# Altium schematic sheet RGB_LEDs.SchDoc: 2225B_VumetreFrequentiel
size 408 x 276 mm; Date: 24.09.2024; DrawnBy: LDA; DocumentNumber: 1.0; SheetNumber: 4; SheetTotal: 6
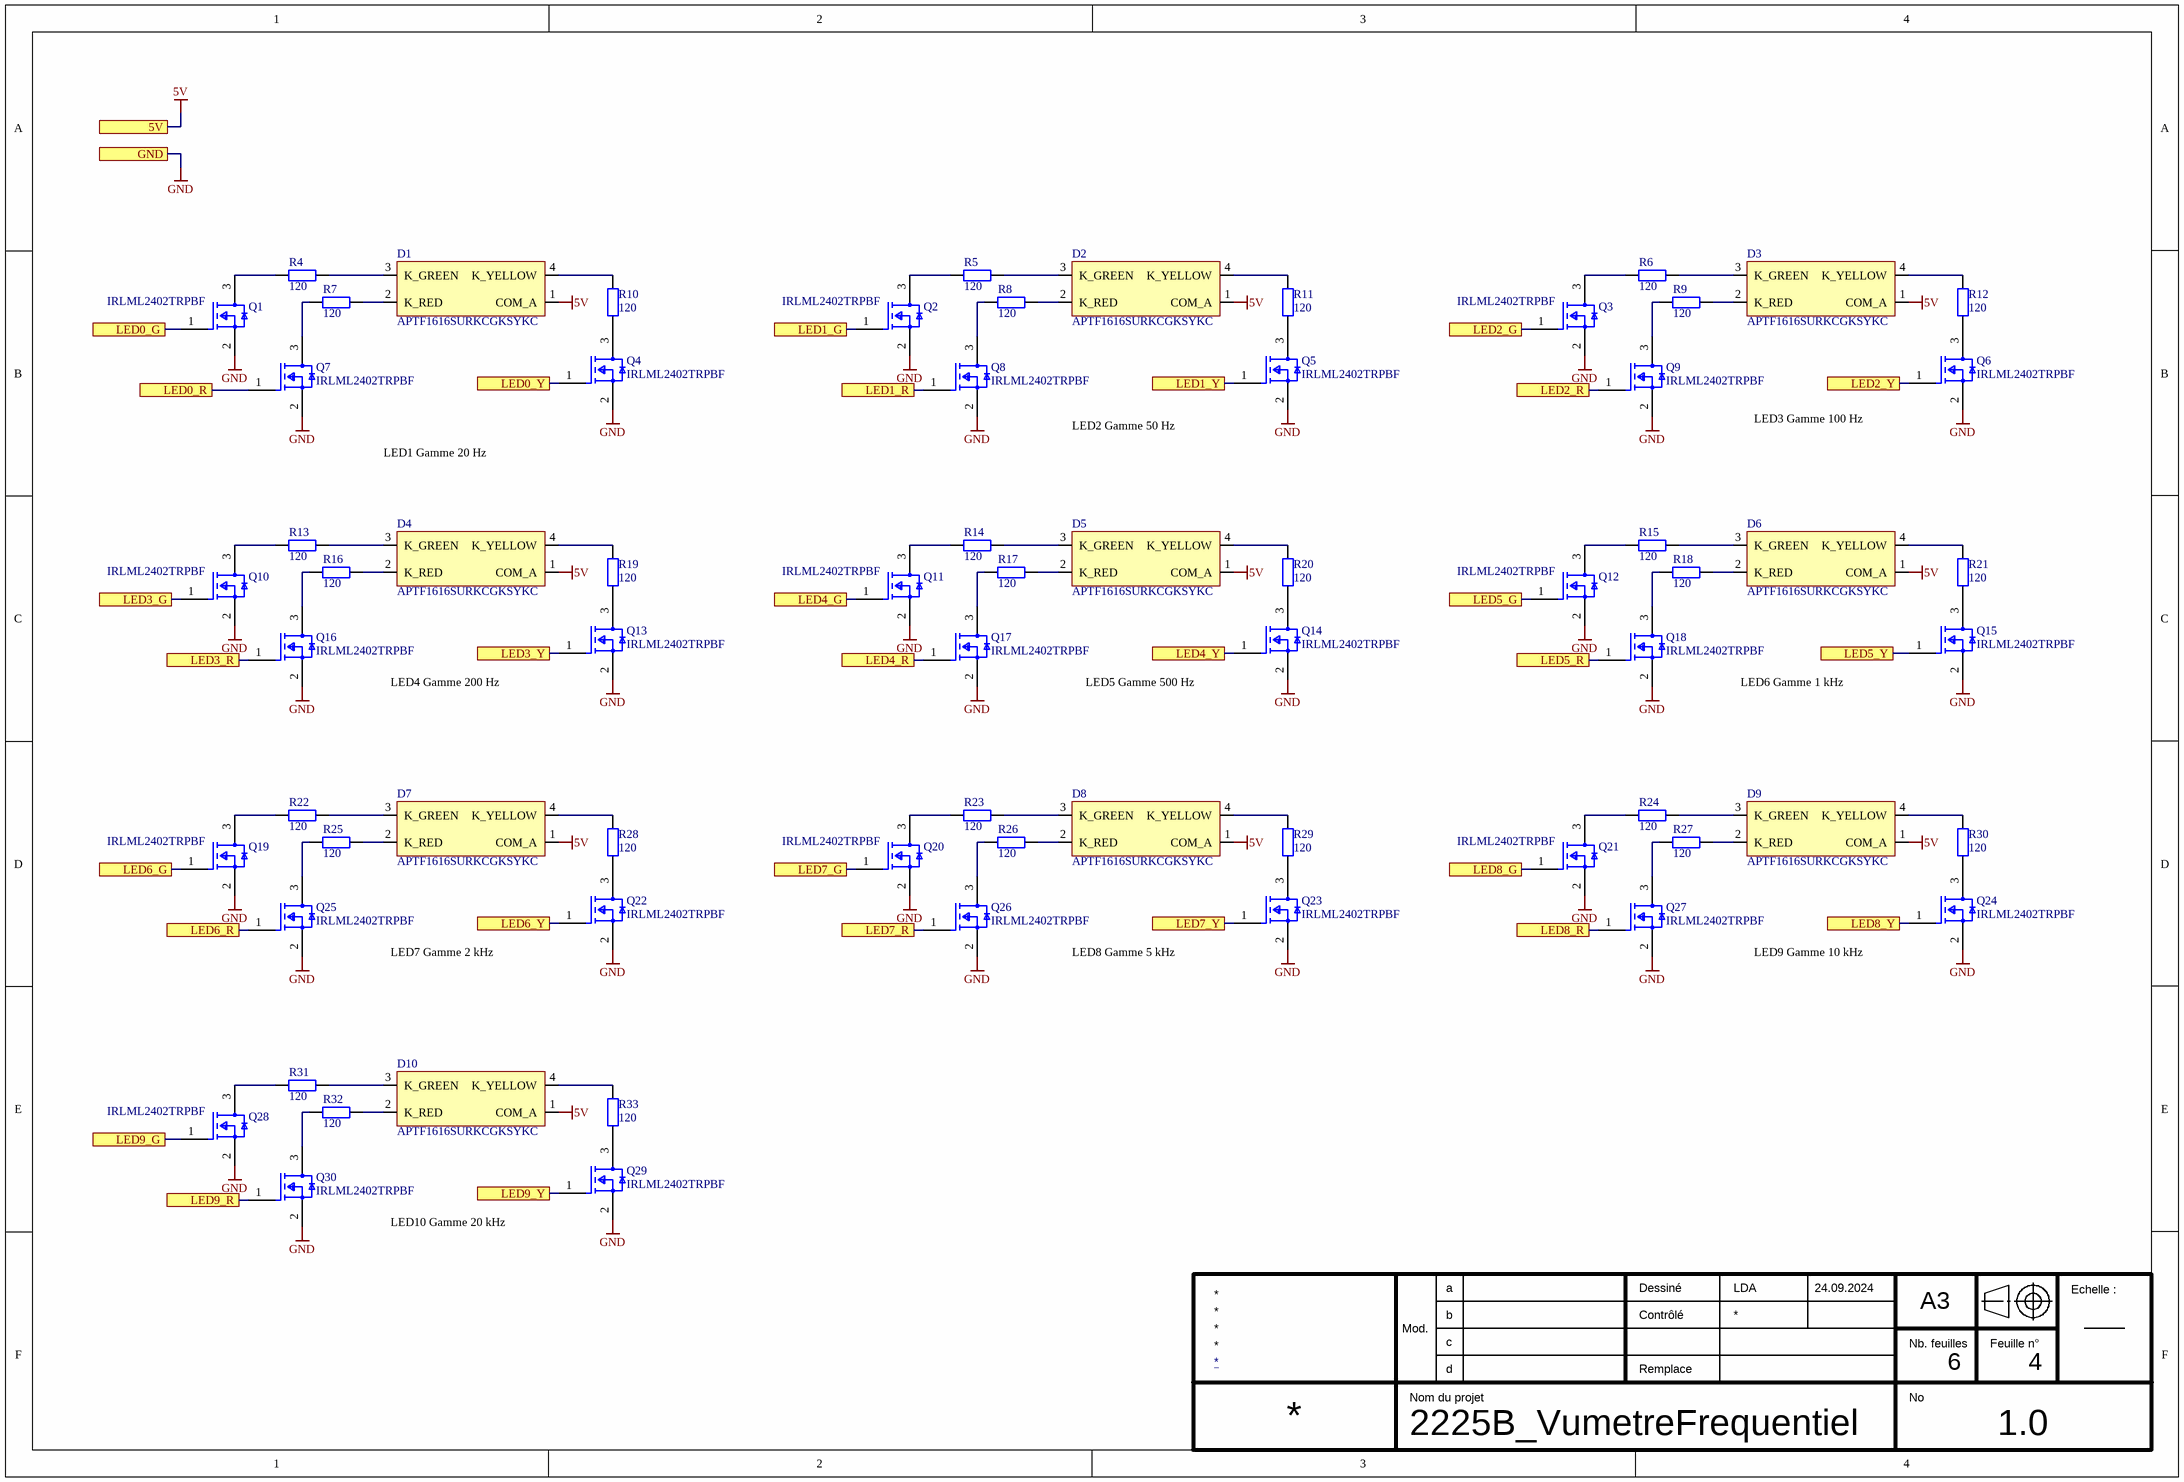
[diagram p0: RGB_LEDs.SchDoc]

## Parts
D1  APTF1616SURKCGKSYKC  [APTF1616SURKCGKSYKC]
D2  APTF1616SURKCGKSYKC  [APTF1616SURKCGKSYKC]
D3  APTF1616SURKCGKSYKC  [APTF1616SURKCGKSYKC]
D4  APTF1616SURKCGKSYKC  [APTF1616SURKCGKSYKC]
D5  APTF1616SURKCGKSYKC  [APTF1616SURKCGKSYKC]
D6  APTF1616SURKCGKSYKC  [APTF1616SURKCGKSYKC]
D7  APTF1616SURKCGKSYKC  [APTF1616SURKCGKSYKC]
D8  APTF1616SURKCGKSYKC  [APTF1616SURKCGKSYKC]
D9  APTF1616SURKCGKSYKC  [APTF1616SURKCGKSYKC]
D10  APTF1616SURKCGKSYKC  [APTF1616SURKCGKSYKC]
Q1  IRLML2402TRPBF  [FP-Micro3-IPC_B]
Q2  IRLML2402TRPBF  [FP-Micro3-IPC_B]
Q3  IRLML2402TRPBF  [FP-Micro3-IPC_B]
Q4  IRLML2402TRPBF  [FP-Micro3-IPC_B]
Q5  IRLML2402TRPBF  [FP-Micro3-IPC_B]
Q6  IRLML2402TRPBF  [FP-Micro3-IPC_B]
Q7  IRLML2402TRPBF  [FP-Micro3-IPC_B]
Q8  IRLML2402TRPBF  [FP-Micro3-IPC_B]
Q9  IRLML2402TRPBF  [FP-Micro3-IPC_B]
Q10  IRLML2402TRPBF  [FP-Micro3-IPC_B]
Q11  IRLML2402TRPBF  [FP-Micro3-IPC_B]
Q12  IRLML2402TRPBF  [FP-Micro3-IPC_B]
Q13  IRLML2402TRPBF  [FP-Micro3-IPC_B]
Q14  IRLML2402TRPBF  [FP-Micro3-IPC_B]
Q15  IRLML2402TRPBF  [FP-Micro3-IPC_B]
Q16  IRLML2402TRPBF  [FP-Micro3-IPC_B]
Q17  IRLML2402TRPBF  [FP-Micro3-IPC_B]
Q18  IRLML2402TRPBF  [FP-Micro3-IPC_B]
Q19  IRLML2402TRPBF  [FP-Micro3-IPC_B]
Q20  IRLML2402TRPBF  [FP-Micro3-IPC_B]
Q21  IRLML2402TRPBF  [FP-Micro3-IPC_B]
Q22  IRLML2402TRPBF  [FP-Micro3-IPC_B]
Q23  IRLML2402TRPBF  [FP-Micro3-IPC_B]
Q24  IRLML2402TRPBF  [FP-Micro3-IPC_B]
Q25  IRLML2402TRPBF  [FP-Micro3-IPC_B]
Q26  IRLML2402TRPBF  [FP-Micro3-IPC_B]
Q27  IRLML2402TRPBF  [FP-Micro3-IPC_B]
Q28  IRLML2402TRPBF  [FP-Micro3-IPC_B]
Q29  IRLML2402TRPBF  [FP-Micro3-IPC_B]
Q30  IRLML2402TRPBF  [FP-Micro3-IPC_B]
R4  120  [RESC2012X06M]
R5  120  [RESC2012X06M]
R6  120  [RESC2012X06M]
R7  120  [RESC2012X06M]
R8  120  [RESC2012X06M]
R9  120  [RESC2012X06M]
R10  120  [RESC2012X06M]
R11  120  [RESC2012X06M]
R12  120  [RESC2012X06M]
R13  120  [RESC2012X06M]
R14  120  [RESC2012X06M]
R15  120  [RESC2012X06M]
R16  120  [RESC2012X06M]
R17  120  [RESC2012X06M]
R18  120  [RESC2012X06M]
R19  120  [RESC2012X06M]
R20  120  [RESC2012X06M]
R21  120  [RESC2012X06M]
R22  120  [RESC2012X06M]
R23  120  [RESC2012X06M]
R24  120  [RESC2012X06M]
R25  120  [RESC2012X06M]
R26  120  [RESC2012X06M]
R27  120  [RESC2012X06M]
R28  120  [RESC2012X06M]
R29  120  [RESC2012X06M]
R30  120  [RESC2012X06M]
R31  120  [RESC2012X06M]
R32  120  [RESC2012X06M]
R33  120  [RESC2012X06M]

## Ports
5V, GND, LED0_G, LED0_R, LED0_Y, LED1_G, LED1_R, LED1_Y, LED2_G, LED2_R, LED2_Y, LED3_G, LED3_R, LED3_Y, LED4_G, LED4_R, LED4_Y, LED5_G, LED5_R, LED5_Y, LED6_G, LED6_R, LED6_Y, LED7_G, LED7_R, LED7_Y, LED8_G, LED8_R, LED8_Y, LED9_G, LED9_R, LED9_Y

## Nets
5V: D1.1(COM_A) D2.1(COM_A) D3.1(COM_A) D4.1(COM_A) D5.1(COM_A) D6.1(COM_A) D7.1(COM_A) D8.1(COM_A) D9.1(COM_A) D10.1(COM_A) ; port 5V
GND: Q1.2(S) Q2.2(S) Q3.2(S) Q4.2(S) Q5.2(S) Q6.2(S) Q7.2(S) Q8.2(S) Q9.2(S) Q10.2(S) Q11.2(S) Q12.2(S) Q13.2(S) Q14.2(S) Q15.2(S) Q16.2(S) Q17.2(S) Q18.2(S) Q19.2(S) Q20.2(S) Q21.2(S) Q22.2(S) Q23.2(S) Q24.2(S) Q25.2(S) Q26.2(S) Q27.2(S) Q28.2(S) Q29.2(S) Q30.2(S) ; port GND
LED0_G: Q1.1(G) ; port LED0_G
LED0_R: Q7.1(G) ; port LED0_R
LED0_Y: Q4.1(G) ; port LED0_Y
LED1_G: Q2.1(G) ; port LED1_G
LED1_R: Q8.1(G) ; port LED1_R
LED1_Y: Q5.1(G) ; port LED1_Y
LED2_G: Q3.1(G) ; port LED2_G
LED2_R: Q9.1(G) ; port LED2_R
LED2_Y: Q6.1(G) ; port LED2_Y
LED3_G: Q10.1(G) ; port LED3_G
LED3_R: Q16.1(G) ; port LED3_R
LED3_Y: Q13.1(G) ; port LED3_Y
LED4_G: Q11.1(G) ; port LED4_G
LED4_R: Q17.1(G) ; port LED4_R
LED4_Y: Q14.1(G) ; port LED4_Y
LED5_G: Q12.1(G) ; port LED5_G
LED5_R: Q18.1(G) ; port LED5_R
LED5_Y: Q15.1(G) ; port LED5_Y
LED6_G: Q19.1(G) ; port LED6_G
LED6_R: Q25.1(G) ; port LED6_R
LED6_Y: Q22.1(G) ; port LED6_Y
LED7_G: Q20.1(G) ; port LED7_G
LED7_R: Q26.1(G) ; port LED7_R
LED7_Y: Q23.1(G) ; port LED7_Y
LED8_G: Q21.1(G) ; port LED8_G
LED8_R: Q27.1(G) ; port LED8_R
LED8_Y: Q24.1(G) ; port LED8_Y
LED9_G: Q28.1(G) ; port LED9_G
LED9_R: Q30.1(G) ; port LED9_R
LED9_Y: Q29.1(G) ; port LED9_Y
NetD1_2: D1.2(K_RED) R7.1
NetD1_3: D1.3(K_GREEN) R4.1
NetD1_4: D1.4(K_YELLOW) R10.1
NetD2_2: D2.2(K_RED) R8.1
NetD2_3: D2.3(K_GREEN) R5.1
NetD2_4: D2.4(K_YELLOW) R11.1
NetD3_2: D3.2(K_RED) R9.1
NetD3_3: D3.3(K_GREEN) R6.1
NetD3_4: D3.4(K_YELLOW) R12.1
NetD4_2: D4.2(K_RED) R16.1
NetD4_3: D4.3(K_GREEN) R13.1
NetD4_4: D4.4(K_YELLOW) R19.1
NetD5_2: D5.2(K_RED) R17.1
NetD5_3: D5.3(K_GREEN) R14.1
NetD5_4: D5.4(K_YELLOW) R20.1
NetD6_2: D6.2(K_RED) R18.1
NetD6_3: D6.3(K_GREEN) R15.1
NetD6_4: D6.4(K_YELLOW) R21.1
NetD7_2: D7.2(K_RED) R25.1
NetD7_3: D7.3(K_GREEN) R22.1
NetD7_4: D7.4(K_YELLOW) R28.1
NetD8_2: D8.2(K_RED) R26.1
NetD8_3: D8.3(K_GREEN) R23.1
NetD8_4: D8.4(K_YELLOW) R29.1
NetD9_2: D9.2(K_RED) R27.1
NetD9_3: D9.3(K_GREEN) R24.1
NetD9_4: D9.4(K_YELLOW) R30.1
NetD10_2: D10.2(K_RED) R32.1
NetD10_3: D10.3(K_GREEN) R31.1
NetD10_4: D10.4(K_YELLOW) R33.1
NetQ1_3: Q1.3(D) R4.2
NetQ2_3: Q2.3(D) R5.2
NetQ3_3: Q3.3(D) R6.2
NetQ4_3: Q4.3(D) R10.2
NetQ5_3: Q5.3(D) R11.2
NetQ6_3: Q6.3(D) R12.2
NetQ7_3: Q7.3(D) R7.2
NetQ8_3: Q8.3(D) R8.2
NetQ9_3: Q9.3(D) R9.2
NetQ10_3: Q10.3(D) R13.2
NetQ11_3: Q11.3(D) R14.2
NetQ12_3: Q12.3(D) R15.2
NetQ13_3: Q13.3(D) R19.2
NetQ14_3: Q14.3(D) R20.2
NetQ15_3: Q15.3(D) R21.2
NetQ16_3: Q16.3(D) R16.2
NetQ17_3: Q17.3(D) R17.2
NetQ18_3: Q18.3(D) R18.2
NetQ19_3: Q19.3(D) R22.2
NetQ20_3: Q20.3(D) R23.2
NetQ21_3: Q21.3(D) R24.2
NetQ22_3: Q22.3(D) R28.2
NetQ23_3: Q23.3(D) R29.2
NetQ24_3: Q24.3(D) R30.2
NetQ25_3: Q25.3(D) R25.2
NetQ26_3: Q26.3(D) R26.2
NetQ27_3: Q27.3(D) R27.2
NetQ28_3: Q28.3(D) R31.2
NetQ29_3: Q29.3(D) R33.2
NetQ30_3: Q30.3(D) R32.2

## Notes on the sheet
- LED1 Gamme 20 Hz
- LED2 Gamme 50 Hz
- LED3 Gamme 100 Hz
- LED4 Gamme 200 Hz
- LED5 Gamme 500 Hz
- LED6 Gamme 1 kHz
- LED7 Gamme 2 kHz
- LED8 Gamme 5 kHz
- LED9 Gamme 10 kHz
- LED10 Gamme 20 kHz
- a
- Dessiné
- A3
- Echelle :
- Mod.
- b
- c
- d
- Contrôlé
- Remplace
- Nb. feuilles
- Feuille n°
- Nom du projet
- No

## Library data of the parts
D1-D10 = APTF1616SURKCGKSYKC: Green, Red, Yellow 570nm Green, 630nm Red, 590nm Yellow LED Indication - Discrete 2.1V Green, 1.95V Red, 2V Yellow 4-SMD, No Lead; Manufacturer_Name: Kingbright; Geometry.Height: 0.9mm; Manufacturer_Part_Number: APTF1616SURKCGKSYKC; Mouser Part Number: 604-APTF1616KCGKSYKC; Mouser Price/Stock: https://www.mouser.co.uk/ProductDetail/Kingbright/APTF1616SURKCGKSYKC?qs=FESYatJ8odK7UleJtP4p0g%3D%3D; Arrow Part Number: APTF1616SURKCGKSYKC; Arrow Price/Stock: https://www.arrow.com/en/products/aptf1616surkcgksykc/kingbright?region=nac; Datasheet Link: https://www.kingbrightusa.com/images/catalog/SPEC/APTF1616SURKCGKSYKC.pdf
Q1-Q30 = CMP-32901-000179-1: MOSFET N-CH 20V 1.2A SOT-23; Max Power Dissipation: 540mW; Gate to Source Voltage (Vgs): 12V; Drain to Source Resistance: 350mR; Rise Time: 9.5ns; Threshold Voltage: 700mV; Turn-On Delay Time: 2.5ns; Input Capacitance: 110pF; Element Configuration: Single; Power Dissipation: 540W; Turn-Off Delay Time: 9.7ns; Rds On Max: 250mR; REACH SVHC: No SVHC; Mount: Surface Mount; Packaging: Tape and Reel; Height: 0.04inch; Drain to Source Voltage (Vdss): 20V; Length: 0.119inch; Contact Plating: Tin; Continuous Drain Current (ID): 1.2A; Lead Free: Lead Free; Drain to Source Breakdown Voltage: 20V; Max Dual Supply Voltage: 20V; Number of Pins: 3; Halogen Free: Halogen Free; Max Operating Temperature: 150°C; Case/Package: SOT-23; Min Operating Temperature: -55°C; Width: 0.055inch
R4-R33 = Res2: Resistor; Published: 8-Jun-2000; LatestRevisionDate: 17-Jul-2002; LatestRevisionNote: Re-released for DXP Platform.; PackageReference: AXIAL-0.4; Publisher: Altium Limited; PackageDescription: Axial Device, Thru-Hole; 2 Leads; 0.4 in Pin Spacing; Value: 120